# Altium project 8x8_Crosspoint_Switch.PrjPcb (part 3 of 4)

## Sheet EEM.SchDoc: EEM connector
size A3; Author: M.Beldyga; CompanyName: WUT ISE; DrawnBy: M.Beldyga; Organization: WUT ISE; Address1: PW ISE; Address2: Nowowiejska 15/19 00-665 Warsaw; Address3: micbeldyga@gmail.com; SheetNumber: 7; SheetTotal: 8; ModifiedBy: -; CheckedDate: -; DivGrp: WUT ISE; Designer: M.Beldyga; ModifiedDate: -; ProjectName: Sensor Box
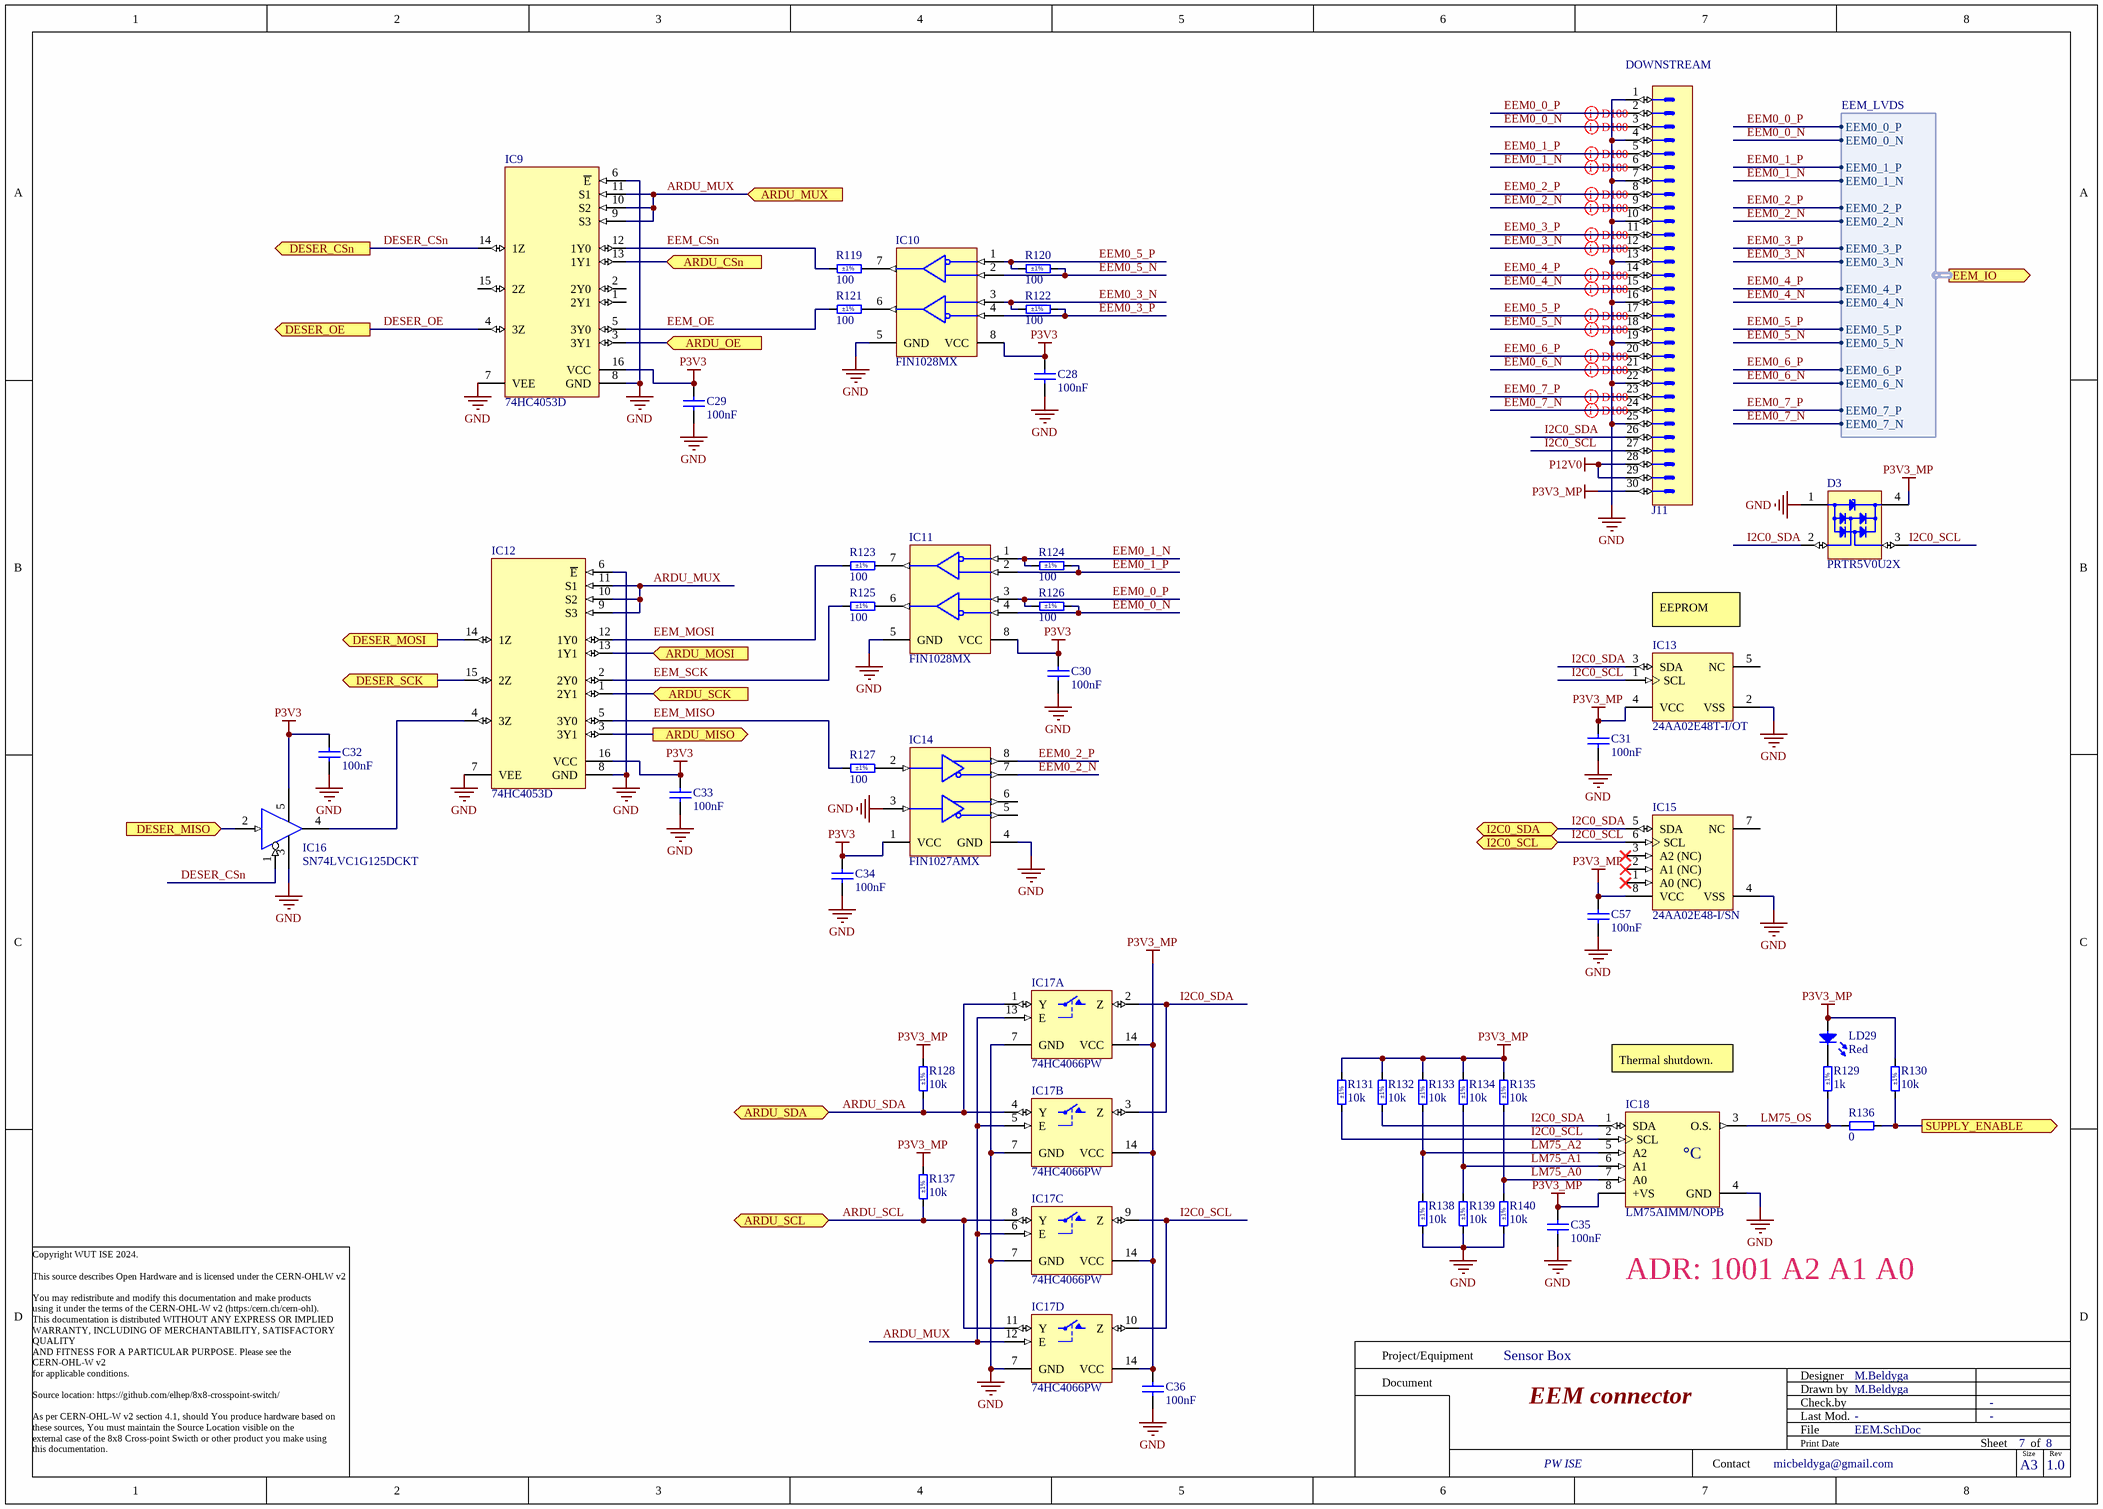
[diagram p6: EEM.SchDoc]

### Parts
C28  100nF  [CAPC1005X55N]
C29  100nF  [CAPC1005X55N]
C30  100nF  [CAPC1005X55N]
C31  100nF  [CAPC1005X55N]
C32  100nF  [CAPC1005X55N]
C33  100nF  [CAPC1005X55N]
C34  100nF  [CAPC1005X55N]
C35  100nF  [CAPC1005X55N]
C36  100nF  [CAPC1005X55N]
C57  100nF  [CAPC1005X55N]
D3  PRTR5V0U2X  [SOT190P230X110-4N]
IC9  74HC4053D  [SOIC127P600X175-16N]
IC10  FIN1028MX  [SOIC127P600X175-8N]
IC11  FIN1028MX  [SOIC127P600X175-8N]
IC12  74HC4053D  [SOIC127P600X175-16N]
IC13  24AA02E48T-I/OT  [SOT95P280X145-5N]
IC14  FIN1027AMX  [SOIC127P600X175-8N]
IC15  24AA02E48-I/SN  [SOIC127P600X175-8N]
IC16  SN74LVC1G125DCKT  [SOT65P210X110-5N]
IC17  74HC4066PW  [SOP65P640X110-14N]  (parts A,B,C,D of 4)
IC18  LM75AIMM/NOPB  [SOP65P490X109-8N]
J11  Header 30  [3M_N2530-6002RB]  (value not drawn)
LD29  Red  [LED_AVAGO_HSMC-C110]
R119  100  Tolerance: ±1%  [RESC1005X40N]
R120  100  Tolerance: ±1%  [RESC1005X40N]
R121  100  Tolerance: ±1%  [RESC1005X40N]
R122  100  Tolerance: ±1%  [RESC1005X40N]
R123  100  Tolerance: ±1%  [RESC1005X40N]
R124  100  Tolerance: ±1%  [RESC1005X40N]
R125  100  Tolerance: ±1%  [RESC1005X40N]
R126  100  Tolerance: ±1%  [RESC1005X40N]
R127  100  Tolerance: ±1%  [RESC1005X40N]
R128  10k  Tolerance: ±1%  [RESC1005X40N]
R129  1k  Tolerance: ±1%  [RESC1005X40N]
R130  10k  Tolerance: ±1%  [RESC1005X40N]
R131  10k  Tolerance: ±1%  [RESC1005X40N]
R132  10k  Tolerance: ±1%  [RESC1005X40N]
R133  10k  Tolerance: ±1%  [RESC1005X40N]
R134  10k  Tolerance: ±1%  [RESC1005X40N]
R135  10k  Tolerance: ±1%  [RESC1005X40N]
R136  0  [RESC1005X40N]
R137  10k  Tolerance: ±1%  [RESC1005X40N]
R138  10k  Tolerance: ±1%  [RESC1005X40N]
R139  10k  Tolerance: ±1%  [RESC1005X40N]
R140  10k  Tolerance: ±1%  [RESC1005X40N]

### Ports
ARDU_CSn (in), ARDU_MISO (out), ARDU_MOSI (in), ARDU_MUX (in), ARDU_OE (in), ARDU_SCK (in), ARDU_SCL (bidir), ARDU_SDA (bidir), DESER_CSn (out), DESER_MISO (in), DESER_MOSI (out), DESER_OE (out), DESER_SCK (out), EEM_IO (out, harness EEM_LVDS), I2C0_SCL (bidir), I2C0_SDA (bidir), SUPPLY_ENABLE (out)

### Harnesses
EEM_LVDS: EEM0_0_P, EEM0_0_N, EEM0_1_P, EEM0_1_N, EEM0_2_P, EEM0_2_N, EEM0_3_P, EEM0_3_N, EEM0_4_P, EEM0_4_N, EEM0_5_P, EEM0_5_N, EEM0_6_P, EEM0_6_N, EEM0_7_P, EEM0_7_N

### Nets
GND: C28.1 C29.1 C30.1 C31.1 C32.1 C33.1 C34.1 C35.1 C36.1 C57.1 D3.1(GND) IC9.6(~{E}) IC9.7(VEE) IC9.8(GND) IC10.5(GND) IC11.5(GND) IC12.6(~{E}) IC12.7(VEE) IC12.8(GND) IC13.2(VSS) IC14.3(DIN2RIN-) IC14.4(GND) IC15.4(VSS) IC16.3(GND) IC17.7(GND) IC18.4(GND) J11.1 J11.4 J11.7 J11.10 J11.13 J11.16 J11.19 J11.22 J11.25 R138.1 R139.1 R140.1
P3V3: C28.2 C29.2 C30.2 C32.2 C33.2 C34.2 IC9.16(VCC) IC10.8(VCC) IC11.8(VCC) IC12.16(VCC) IC14.1(VCC) IC16.5(VCC)
P3V3_MP: C31.2 C35.2 C36.2 C57.2 D3.4(VCC) IC13.4(VCC) IC15.8(VCC) IC17.14(VCC) IC18.8(+VS) J11.30 LD29.2(A) R128.2 R130.2 R131.2 R132.2 R133.2 R134.2 R135.2 R137.2
P12V0: J11.28 J11.29
ARDU_CSn: IC9.13(1Y1) ; port ARDU_CSn
ARDU_MISO: IC12.3(3Y1) ; port ARDU_MISO
ARDU_MOSI: IC12.13(1Y1) ; port ARDU_MOSI
ARDU_MUX: IC9.9(S3) IC9.10(S2) IC9.11(S1) IC12.9(S3) IC12.10(S2) IC12.11(S1) IC17.5(E) IC17.6(E) IC17.12(E) IC17.13(E) ; port ARDU_MUX
ARDU_OE: IC9.3(3Y1) ; port ARDU_OE
ARDU_SCK: IC12.1(2Y1) ; port ARDU_SCK
ARDU_SCL: IC17.8(Y) IC17.11(Y) R137.1 ; port ARDU_SCL
ARDU_SDA: IC17.1(Y) IC17.4(Y) R128.1 ; port ARDU_SDA
DESER_CSn: IC9.14(1Z) IC16.1(~{G}) ; port DESER_CSn
DESER_MISO: IC16.2(IN) ; port DESER_MISO
DESER_MOSI: IC12.14(1Z) ; port DESER_MOSI
DESER_OE: IC9.4(3Z) ; port DESER_OE  [project net DESER_~{OE}]
DESER_SCK: IC12.15(2Z) ; port DESER_SCK
EEM0_0_N: IC11.4(RIN2-) J11.3 R126.2 ; port EEM_IO.EEM0_0_N
EEM0_0_P: IC11.3(RIN2+) J11.2 R126.1 ; port EEM_IO.EEM0_0_P
EEM0_1_N: IC11.1(RIN1-) J11.6 R124.1 ; port EEM_IO.EEM0_1_N
EEM0_1_P: IC11.2(RIN1+) J11.5 R124.2 ; port EEM_IO.EEM0_1_P
EEM0_2_N: IC14.7(DOUT-) J11.9 ; port EEM_IO.EEM0_2_N
EEM0_2_P: IC14.8(DOUT+) J11.8 ; port EEM_IO.EEM0_2_P
EEM0_3_N: IC10.3(RIN2+) J11.12 R122.1 ; port EEM_IO.EEM0_3_N
EEM0_3_P: IC10.4(RIN2-) J11.11 R122.2 ; port EEM_IO.EEM0_3_P
EEM0_4_N: J11.15 ; port EEM_IO.EEM0_4_N
EEM0_4_P: J11.14 ; port EEM_IO.EEM0_4_P
EEM0_5_N: IC10.2(RIN1+) J11.18 R120.2 ; port EEM_IO.EEM0_5_N
EEM0_5_P: IC10.1(RIN1-) J11.17 R120.1 ; port EEM_IO.EEM0_5_P
EEM0_6_N: J11.21 ; port EEM_IO.EEM0_6_N
EEM0_6_P: J11.20 ; port EEM_IO.EEM0_6_P
EEM0_7_N: J11.24 ; port EEM_IO.EEM0_7_N
EEM0_7_P: J11.23 ; port EEM_IO.EEM0_7_P
EEM_CSn: IC9.12(1Y0) R119.1
EEM_MISO: IC12.5(3Y0) R127.1
EEM_MOSI: IC12.12(1Y0) R123.1
EEM_OE: IC9.5(3Y0) R121.1
EEM_SCK: IC12.2(2Y0) R125.1
I2C0_SCL: D3.3(I/O2) IC13.1(SCL) IC15.6(SCL) IC17.9(Z) IC17.10(Z) IC18.2(SCL) J11.27 R131.1 ; port I2C0_SCL
I2C0_SDA: D3.2(I/O1) IC13.3(SDA) IC15.5(SDA) IC17.2(Z) IC17.3(Z) IC18.1(SDA) J11.26 R132.1 ; port I2C0_SDA
LM75_A0: IC18.7(A0) R135.1 R140.2
LM75_A1: IC18.6(A1) R134.1 R139.2
LM75_A2: IC18.5(A2) R133.1 R138.2
LM75_OS: IC18.3(O.S.) R129.1 R136.1
P3V7_EN: R130.1 R136.2 ; port SUPPLY_ENABLE
NetIC10_6: IC10.6(ROUT2) R121.2
NetIC10_7: IC10.7(ROUT1) R119.2
NetIC11_6: IC11.6(ROUT2) R125.2
NetIC11_7: IC11.7(ROUT1) R123.2
NetIC12_4: IC12.4(3Z) IC16.4(OUT)
NetIC14_2: IC14.2(DIN1) R127.2
NetLD29_1: LD29.1(C) R129.2

Not connected (* = marked no-connect by the designer): IC9 1(2Y1) 2(2Y0) 15(2Z); IC13 5(NC); IC14 5(DOUT-) 6(DOUT+); IC15 1(A0_(NC))* 2(A1_(NC))* 3(A2_(NC))* 7(NC)

### Layout directives
differential pair; net class D100: EEM0_0_N, EEM0_0_P, EEM0_1_N, EEM0_1_P, EEM0_2_N, EEM0_2_P, EEM0_3_N, EEM0_3_P, EEM0_4_N, EEM0_4_P, EEM0_5_N, EEM0_5_P, EEM0_6_N, EEM0_6_P, EEM0_7_N, EEM0_7_P

### Notes on the sheet
- (near J11) DOWNSTREAM
- (near IC13) EEPROM
- Thermal shutdown.
- ADR: 1001 A2 A1 A0
- Copyright WUT ISE 2024.
  This source describes Open Hardware and is licensed under the CERN-OHLW v2
  You may redistribute and modify this documentation and make products
  using it under the terms of the CERN-OHL-W v2 (https:/cern.ch/cern-ohl).
  This documentation is distributed WITHOUT ANY EXPRESS OR IMPLIED
  WARRANTY, INCLUDING OF MERCHANTABILITY, SATISFACTORY QUALITY
  AND FITNESS FOR A PARTICULAR PURPOSE. Please see the CERN-OHL-W v2
  for applicable conditions.
  Source location: https://github.com/elhep/8x8-crosspoint-switch/
  As per CERN-OHL-W v2 section 4.1, should You produce hardware based on
  these sources, You must maintain the Source Location visible on the
  external case of the 8x8 Cross-point Swicth or other product you make using
  this documentation.
- Project/Equipment
- Document
- Designer
- Drawn by
- Check.by
- Contact
- File
- Last Mod.
- Print Date
- Sheet
- Size
- A3
- of
- Rev
- (in symbol LM75AIMM/NOPB) °C

### Library data of the parts
C28-C36 C57 = CC0402_100NF_50V_10%_X7R: as C23-C26 on sheet Crosspoint_control; Part Number: CC0402_100NF_50V_10%_X7R; Component Kind: Standard; Component Type: Standard; Pin Count: 2; Value: 100nF; Status: None; Manufacturer Part Number: CC0402_100NF_50V_10%_X7R; Case: 0402; Mounted: Yes; Socket: No; SMD: Yes; Sense: No; Manufacturer1 Example: MURATA; Manufacturer1 ComponentHeight: 0.55mm; HelpURL: \\cern.ch\dfs\Applications\Altium\Datasheets\CC0402_MURATA_GRM155R71H104KE14D.pdf; Author: CERN DEM MR; CreateDate: 6/30/2017; LatestRevisionDate: 6/30/2017
D3 = PRTR5V0U2X: Ultra Low Capacitance Double Rail-to-Rail ESD Protection Diode; Part Description: Ultra Low Capacitance (1pF) Double Rail-to-Rail ESD Protection Diode (8kV); Manufacturer: NXP SEMICONDUCTORS; Voltage: 5.5V; PressFit: No; Bonding: No; Part Number: PRTR5V0U2X; Component Kind: Standard; Component Type: Standard; Device: PRTR5V0U2X; PackageDescription: SOT143B, SOT, 1.90mm Pitch; 4 Pin, 1.30mm W X 2.90mm L X 1.10mm H body, IPC Medium Density; Manufacturer Part Number: PRTR5V0U2X; Pin Count: 4; Case: SOT143B; Mounted: Yes; Socket: No; SMD: Yes; Sense: No; ComponentHeight: 1.1mm; HelpURL: \\cern.ch\dfs\Applications\Altium\Datasheets\PRTR5V0U2X.pdf; Author: CERN DEM JLC; CreateDate: 3/22/2011; LatestRevisionDate: 3/22/2011
IC9 IC12 = 74HC4053D: Triple 2-Channel Analog Multiplexer/Demultiplexer; Manufacturer: NXP SEMICONDUCTORS; PressFit: No; Bonding: No; Part Number: 74HC4053D; Component Kind: Standard; Component Type: Standard; Device: 74HC4053D; PackageDescription: SOIC 16, Pitch 1.27mm - Body 4x10mm, IPC Medium Density; Part Description: Triple 2-channel analog multiplexer/demultiplexer; Manufacturer Part Number: 74HC4053D; Pin Count: 16; Case: SOIC16; Mounted: Yes; Socket: No; SMD: Yes; Sense: No; ComponentHeight: 1.75mm; Author: CERN DEM JLC; HelpURL: \\cern.ch\dfs\Applications\Altium\Datasheets\74HC4053D.pdf; CreateDate: 11/9/2016; LatestRevisionDate: 11/9/2016
IC10 IC11 = FIN1028: 3.3V LVDS 2-Bit High-Speed Differential Reciever; Manufacturer: ON Semiconductor; PressFit: No; Bonding: No; Part Number: FIN1028MX; Component Kind: Standard; Component Type: Standard; Device: FIN1028MX; PackageDescription: SOIC 8, Pitch 1.27mm - Body 4x5mm, IPC Medium Density; Part Description: 3.3V LVDS 2-Bit High-Speed Differential Reciever; Manufacturer Part Number: FIN1028MX; Pin Count: 8; Case: SOIC8; Mounted: Yes; Socket: No; SMD: Yes; Sense: No; ComponentHeight: 0.8mm; Author: GK; HelpURL: \\cern.ch\dfs\Applications\Altium\Datasheets\FIN1101K8X.pdf; CreateDate: 08/11/2016; LatestRevisionDate: 08/11/2016
IC13 = 24AA02E48T-I/OT: 1.7V-5.5V, 2K I2C Serial EEPROM With EUI-48 Node Identity; Manufacturer: MICROCHIP TECHNOLOGY; PressFit: No; Bonding: No; Part Number: 24AA02E48T-I/OT; Component Kind: Standard; Component Type: Standard; Device: 24AA02E48T-I/OT; PackageDescription: SOT, 0.95mm pitch; 5 pin, 1.60mm W X 2.90mm L X 1.45mm H body, IPC Medium Density; Part Description: 1.7V-5.5V, 2K I2C Serial EEPROM with EUI-48 Node Identity; Manufacturer Part Number: 24AA02E48T-I/OT; Pin Count: 5; Case: SOT23-5; Mounted: Yes; Socket: No; SMD: Yes; Sense: No; ComponentHeight: 1.45mm; HelpURL: \\cern.ch\dfs\Applications\Altium\Datasheets\24AA02E48T-I-OT.pdf; Author: CERN DEM MR; CreateDate: 3/31/2016; LatestRevisionDate: 3/31/2016
IC14 = FIN1027A: 3.3V LVDS, 2-Bit, High-Speed, Differential Driver; Manufacturer: ON Semiconductor; PressFit: No; Bonding: No; Part Number: FIN1027AMX; Component Kind: Standard; Component Type: Standard; Device: FIN1027AMX; PackageDescription: SOIC 8, Pitch 1.27mm - Body 4x5mm, IPC Medium Density; Part Description: 3.3V LVDS, 2-Bit, High-Speed, Differential Driver; Manufacturer Part Number: FIN1027AMX; Pin Count: 8; Case: SOIC8; Mounted: Yes; Socket: No; SMD: Yes; Sense: No; ComponentHeight: 0.8mm; Author: GK; HelpURL: \\cern.ch\dfs\Applications\Altium\Datasheets\FIN1101K8X.pdf; CreateDate: 08/11/2016; LatestRevisionDate: 08/11/2016
IC15 = MEM_24AA02E48-I/SN: 1.7V-5.5V, 2K I2C™ Serial EEPROMs with EUI-48™ Node Identity; Manufacturer: MICROCHIP TECHNOLOGY; PressFit: No; Bonding: No; Part Number: 24AA02E48-I/SN; Component Kind: Standard; Component Type: Standard; Device: 24AA02E48-I/SN; PackageDescription: SOIC, 1.27mm Pitch; 8 Pin - Body 4x5mm, IPC Medium Density; Part Description: 1.7V-5.5V, 2K I2C™ Serial EEPROMs with EUI-48™ Node Identity; Manufacturer Part Number: 24AA02E48-I/SN; Pin Count: 8; Case: SOIC8; Mounted: Yes; Socket: No; SMD: Yes; Sense: No; ComponentHeight: 1.75mm; HelpURL: \\cern.ch\dfs\Applications\Altium\Datasheets\24AA025E48-I-SN.pdf; Author: CERN DEM MR; CreateDate: 19.07.2016; LatestRevisionDate: 19.07.2016
IC16 = 741G125: Single Bus Buffer Gate With 3-State Output; Part Description: Single Bus Buffer Gate With 3-State Outputs; Manufacturer: TEXAS INSTRUMENTS; PressFit: No; Bonding: No; Part Number: SN74LVC1G125DCKT; Component Kind: Standard; Component Type: Standard; Device: SN74LVC1G125DCKT; PackageDescription: SOT353, SC70-5, SOT, 0.65mm Pitch, 5 pin, 1.25mm W X 2.00mm L X 1.10mm H, IPC Medium Density; Manufacturer Part Number: SN74LVC1G125DCKT; Pin Count: 5; Case: SOT353; Mounted: Yes; Socket: No; SMD: Yes; Sense: No; ComponentHeight: 1.1mm; Author: CERN DEM JLC; HelpURL: \\cern.ch\dfs\Applications\Altium\Datasheets\SN74LVC1G125DCKT.pdf; CreateDate: 12/19/2011; LatestRevisionDate: 12/19/2011
IC17 = 74HC4066PW: Quad Single-Pole Single-Throw Analog Switch; Manufacturer: NXP SEMICONDUCTORS; PressFit: No; Bonding: No; Part Number: 74HC4066PW; Component Kind: Standard; Component Type: Standard; Device: 74HC4066PW; PackageDescription: SOP, 0.65mm Pitch; 14 Pin, 4.40mm W X 5.00mm L X 1.20mm H body, IPC Medium Density; Part Description: Quad Single-Pole Single-Throw Analog Switch; Manufacturer Part Number: 74HC4066PW; Pin Count: 14; Case: TSSOP14; Mounted: Yes; Socket: No; SMD: Yes; Sense: No; ComponentHeight: 1.1mm; Author: CERN DEM JLC; HelpURL: \\cern.ch\dfs\Applications\Altium\Datasheets\74HC4066PW.pdf; CreateDate: 11/19/2014; LatestRevisionDate: 11/19/2014
IC18 = LM75AIMM/NOPB: Digital Temperature Sensor and Thermal Watchdog with Two-Wire Interface; Part Description: -25° to +100°C ±2°C Digital Temperature Sensor and Thermal Watchdog with Two-Wire Interface; Manufacturer: TEXAS INSTRUMENTS; PressFit: No; Bonding: No; Part Number: LM75AIMM/NOPB; Component Kind: Standard; Component Type: Standard; Device: LM75AIMM/NOPB; PackageDescription: SOP, 0.65mm Pitch; 8 Pin, 3.00mm W X 3.00mm L X 1.09mm H body, IPC Medium Density; Manufacturer Part Number: LM75AIMM; Pin Count: 8; Case: SSOP8; Mounted: Yes; Socket: No; SMD: Yes; Sense: No; ComponentHeight: 1.09mm; HelpURL: \\cern.ch\dfs\Applications\Altium\Datasheets\LM75AIMM-NOPB.pdf; Author: CERN DEM JLC; CreateDate: 10/15/2012; LatestRevisionDate: 6/1/2022
J11 = 3M_N2530-6002RB: Connector 30 Male; Part Description: 30 Contacts, Straight .100'' x .100'' Low Profile Four-Wall Header, (Solder Tail 2.84mm), 2500 Series; Manufacturer: 3M; PressFit: No; Part Number: 3M_N2530-6002RB; Component Kind: Standard; Component Type: Standard; Pin Count: 30; Family: Header 30; Mounted: Yes; Socket: No; SMD: No; Sense: No; Status: None; Manufacturer Part Number: N2530-6002RB; ComponentHeight: 10.03mm; HelpURL: \\cern.ch\dfs\Applications\Altium\Datasheets\3M_N2530-6002RB.pdf; Author: CERN DEM JLC; CreateDate: 2/11/2009; LatestRevisionDate: 10/27/2022
LD29 = LED_AVAGO_HSMC-C110: LED Red 1C 2A; Part Description: High Performance Right Angle Chip Red LED; Manufacturer: AVAGO TECHNOLOGIES; PressFit: No; Bonding: No; Part Number: LED_AVAGO_HSMC-C110; Component Kind: Standard; Component Type: Standard; Color: Red; PackageDescription: Red Chip LED, 2-Leads, Body 3.3x1.6mm, Side Emitting Package; Manufacturer Part Number: HSMC-C110; Pin Count: 2; Case: 1206; Mounted: Yes; Socket: No; SMD: Yes; Sense: No; ComponentHeight: 1.1mm; HelpURL: \\cern.ch\dfs\Applications\Altium\Datasheets\LED_AVAGO_HSMC-C110.pdf; ComponentLink1URL: \\cern.ch\dfs\Applications\Altium\Datasheets\LED_AVAGO_HSMC-C110_DESIGN-GUIDE.pdf; ComponentLink1Description: Design Guide; Author: CERN DEM JMW; CreateDate: 7/30/2009; LatestRevisionDate: 6/20/2012
R119-R127 = R0402_100R_1%_0.1W_100PPM: Resistor - 1%; Part Description: General Purpose Thick Film Chip Resistor; Manufacturer: GENERIC; Manufacturer Part Number: R0402_100R_1%_0.1W_100PPM_50V; Manufacturer1 Part Number: ERJ2RKF1000X; Power: 0.1W; TC: ±100ppm/°C; Voltage: 50V; PressFit: No; Part Number: R0402_100R_1%_0.1W_100PPM; Component Kind: Standard; Component Type: Standard; Pin Count: 2; Value: 100; Status: Not Recommended; Case: 0402; Mounted: Yes; Sense: No; Socket: No; SMD: Yes; Manufacturer1 Example: PANASONIC; Manufacturer1 ComponentHeight: 0.4mm; HelpURL: \\cern.ch\dfs\Applications\Altium\Datasheets\R0402_PANASONIC_ERJ2RK.pdf; Author: CERN DEM JLC; CreateDate: 12/12/2013; LatestRevisionDate: 3/3/2015
R128 R130-R135 R137-R140 = R0402_10K_1%_0.0625W_100PPM: Resistor - 1%; Part Description: General Purpose Thick Film Chip Resistor; Manufacturer: GENERIC; Manufacturer1 Part Number: 232270671003L; TC: ±100ppm/°C; PressFit: No; Part Number: R0402_10K_1%_0.0625W_100PPM; Component Kind: Standard; Component Type: Standard; Pin Count: 2; Value: 10k; Status: Not Recommended; Power: 0.0625W; Manufacturer Part Number: R0402_10K_1%_0.0625W_100PPM; Case: 0402; Mounted: Yes; Sense: No; Socket: No; SMD: Yes; Manufacturer1 Example: YAGEO PHYCOMP; Manufacturer1 ComponentHeight: 0.4mm; HelpURL: \\cern.ch\dfs\Applications\Altium\Datasheets\R0402_Phycomp_RC0402.pdf; Author: CERN DEM JLC; CreateDate: 12/3/2007; LatestRevisionDate: 10/17/2012
R129 = R0402_1K_1%_0.0625W_100PPM: Resistor - 1%; Part Description: General Purpose Thick Film Chip Resistor; Manufacturer: GENERIC; Manufacturer1 Part Number: 232270671002L; TC: ±100ppm/°C; PressFit: No; Part Number: R0402_1K_1%_0.0625W_100PPM; Component Kind: Standard; Component Type: Standard; Pin Count: 2; Value: 1k; Status: Not Recommended; Power: 0.0625W; Manufacturer Part Number: R0402_1K_1%_0.0625W_100PPM; Case: 0402; Mounted: Yes; Sense: No; Socket: No; SMD: Yes; Manufacturer1 Example: YAGEO PHYCOMP; Manufacturer1 ComponentHeight: 0.4mm; HelpURL: \\cern.ch\dfs\Applications\Altium\Datasheets\R0402_Phycomp_RC0402.pdf; Author: CERN DEM JLC; CreateDate: 12/3/2007; LatestRevisionDate: 10/17/2012
R136 = R0402_0R_JUMPER: Resistor; Part Description: 1A (0.05R Max DC Resistance) Zero Ohm Jumper; Manufacturer: GENERIC; Manufacturer1 Part Number: 232270591001L; PressFit: No; Part Number: R0402_0R_JUMPER; Component Kind: Standard; Component Type: Standard; Pin Count: 2; Value: 0; Status: Not Recommended; Manufacturer Part Number: R0402_0R_JUMPER; Case: 0402; Mounted: Yes; Sense: No; Socket: No; SMD: Yes; Manufacturer1 Example: YAGEO PHYCOMP; Manufacturer1 ComponentHeight: 0.4mm; HelpURL: \\cern.ch\dfs\Applications\Altium\Datasheets\R0402_Phycomp_RC0402.pdf; Author: CERN DEM JLC; CreateDate: 12/3/2007; LatestRevisionDate: 10/17/2012

## Sheet Supply.SchDoc: Power Supply
size A3; Author: M.Beldyga; CompanyName: WUT ISE; DrawnBy: M.Beldyga; Organization: WUT ISE; Address1: PW ISE; Address2: Nowowiejska 15/19 00-665 Warsaw; Address3: micbeldyga@gmail.com; SheetNumber: 8; SheetTotal: 8; ModifiedBy: -; CheckedDate: -; DivGrp: WUT ISE; Designer: M.Beldyga; ModifiedDate: -; ProjectName: Sensor Box
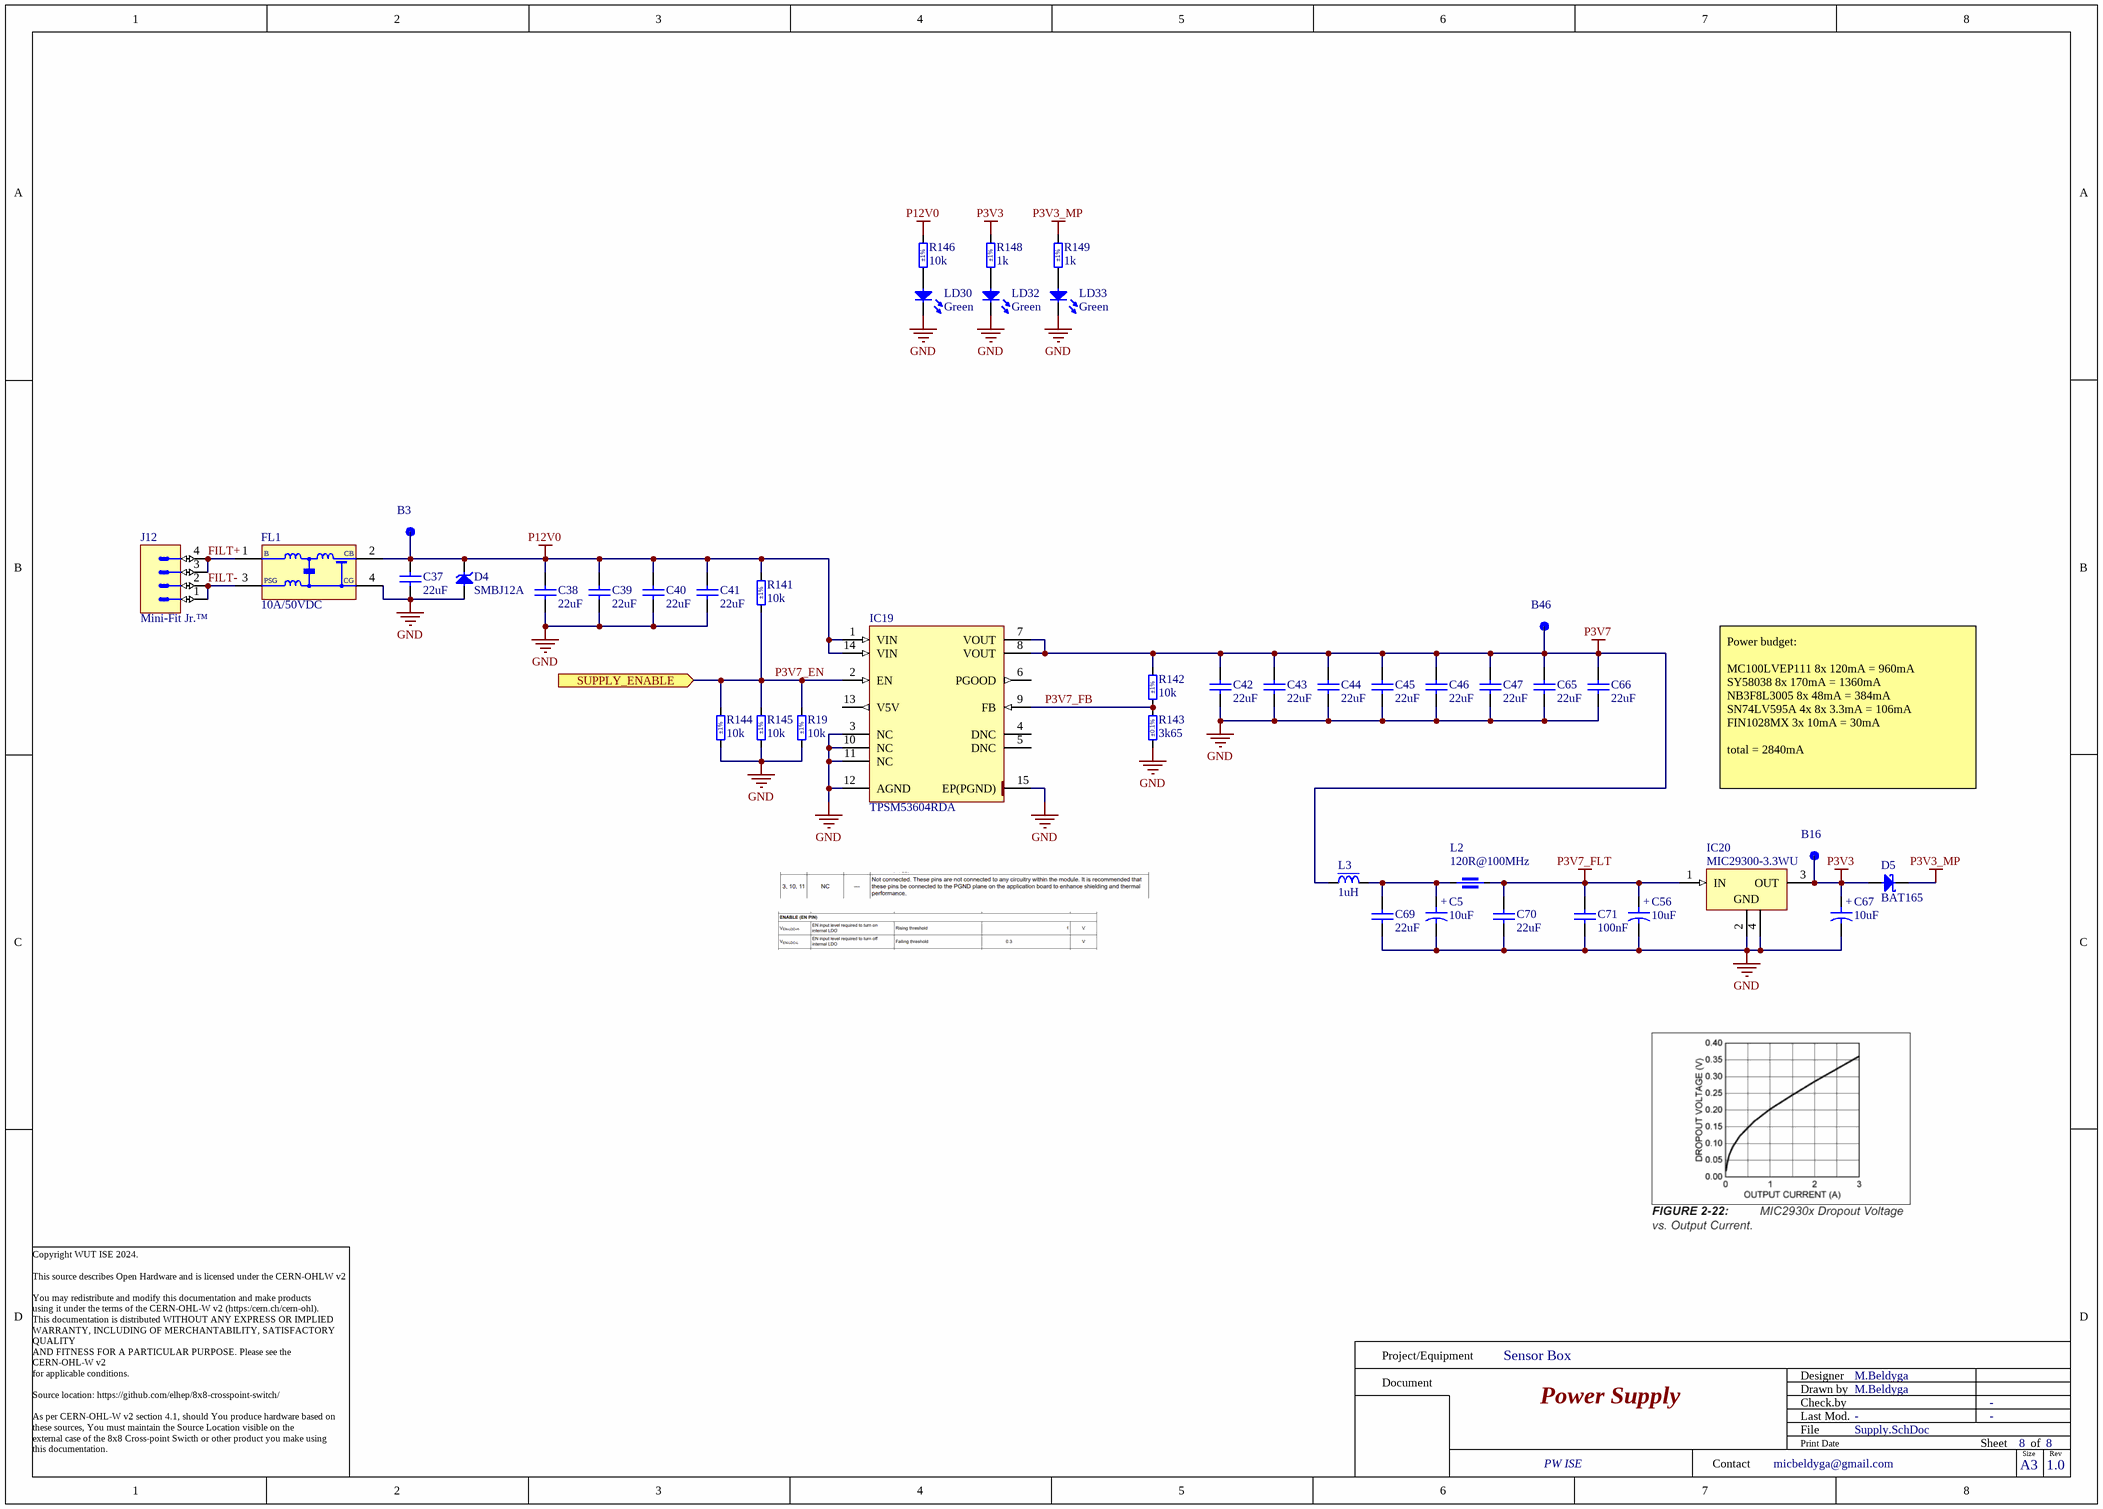
[diagram p7: Supply.SchDoc]

### Parts
B3  SMD Pad  [C100]  (value not drawn)  (no BOM)
B16  SMD Pad  [C100]  (value not drawn)  (no BOM)
B46  SMD Pad  [C100]  (value not drawn)  (no BOM)
C5  10uF  [CAPMP3216X180N]
C37  22uF  [CAPC2012X135N]
C38  22uF  [CAPC2012X135N]
C39  22uF  [CAPC2012X135N]
C40  22uF  [CAPC2012X135N]
C41  22uF  [CAPC2012X135N]
C42  22uF  [CAPC2012X135N]
C43  22uF  [CAPC2012X135N]
C44  22uF  [CAPC2012X135N]
C45  22uF  [CAPC2012X135N]
C46  22uF  [CAPC2012X135N]
C47  22uF  [CAPC2012X135N]
C56  10uF  [CAPMP3216X180N]
C65  22uF  [CAPC2012X135N]
C66  22uF  [CAPC2012X135N]
C67  10uF  [CAPMP3216X180N]
C69  22uF  [CAPC2012X135N]
C70  22uF  [CAPC2012X135N]
C71  100nF  [CAPC1005X55N]
D4  SMBJ12A  [DIOM5336X265N]
D5  BAT165  [SOD2512X110N]
FL1  10A/50VDC  [FIL_MURATA_BNX02]
IC19  TPSM53604RDA  [TEXAS_RDA0015A (B3QFN)]
IC20  MIC29300-3.3WU  [TO254P1524X460-4N-S769X1066]
J12  Mini-Fit Jr.™  [MOLEX_39-30-0040]
L2  120R@100MHz  [INDC1608X65N]
L3  1uH  [IND_COILCRAFT_PFL3215]
LD30  Green  [LED_KINGBRIGHT_KP-1608CGCK]
LD32  Green  [LED_KINGBRIGHT_KP-1608CGCK]
LD33  Green  [LED_KINGBRIGHT_KP-1608CGCK]
R19  10k  Tolerance: ±1%  [RESC1005X40N]
R141  10k  Tolerance: ±1%  [RESC1005X40N]
R142  10k  Tolerance: ±1%  [RESC1005X40N]
R143  3k65  Tolerance: ±0.1%  [RESC1608X55N]
R144  10k  Tolerance: ±1%  [RESC1005X40N]
R145  10k  Tolerance: ±1%  [RESC1005X40N]
R146  10k  Tolerance: ±1%  [RESC1005X40N]
R148  1k  Tolerance: ±1%  [RESC1005X40N]
R149  1k  Tolerance: ±1%  [RESC1005X40N]

### Ports
SUPPLY_ENABLE (in)

### Nets
GND: C5.2 C37.1 C38.1 C39.1 C40.1 C41.1 C42.1 C43.1 C44.1 C45.1 C46.1 C47.1 C56.2 C65.1 C66.1 C67.2 C69.1 C70.1 C71.1 D4.2(A) FL1.4(CG) IC19.3(NC) IC19.10(NC) IC19.11(NC) IC19.12(AGND) IC19.15(EP(PGND)) IC20.2(GND) IC20.4(GND) LD30.1(C) LD32.1(C) LD33.1(C) R19.2 R143.1 R144.2 R145.2
P3V3: B16.1 C67.1 D5.2(A) IC20.3(OUT) R148.2
P3V3_MP: D5.1(C) R149.2
P3V7: B46.1 C42.2 C43.2 C44.2 C45.2 C46.2 C47.2 C65.2 C66.2 IC19.7(VOUT) IC19.8(VOUT) L3.1 R142.1
P3V7_FLT: C56.1 C70.2 C71.2 IC20.1(IN) L2.2
P12V0: B3.1 C37.2 C38.2 C39.2 C40.2 C41.2 D4.1(C) FL1.2(CB) IC19.1(VIN) IC19.14(VIN) R141.1 R146.1
FILT+: FL1.1(B) J12.3 J12.4
FILT-: FL1.3(PSG) J12.1 J12.2
P3V7_EN: IC19.2(EN) R19.1 R141.2 R144.1 R145.1 ; port SUPPLY_ENABLE
P3V7_FB: IC19.9(FB) R142.2 R143.2
NetC5_1: C5.1 C69.2 L2.1 L3.2
NetLD30_2: LD30.2(A) R146.2
NetLD32_2: LD32.2(A) R148.1
NetLD33_2: LD33.2(A) R149.1

Not connected (* = marked no-connect by the designer): IC19 4(DNC) 5(DNC) 6(PGOOD) 13(V5V)

### Notes on the sheet
- Power budget:
  MC100LVEP111 8x 120mA = 960mA
  SY58038 8x 170mA = 1360mA
  NB3F8L3005 8x 48mA = 384mA
  SN74LV595A 4x 8x 3.3mA = 106mA
  FIN1028MX 3x 10mA = 30mA
  total = 2840mA
- Copyright WUT ISE 2024.
  This source describes Open Hardware and is licensed under the CERN-OHLW v2
  You may redistribute and modify this documentation and make products
  using it under the terms of the CERN-OHL-W v2 (https:/cern.ch/cern-ohl).
  This documentation is distributed WITHOUT ANY EXPRESS OR IMPLIED
  WARRANTY, INCLUDING OF MERCHANTABILITY, SATISFACTORY QUALITY
  AND FITNESS FOR A PARTICULAR PURPOSE. Please see the CERN-OHL-W v2
  for applicable conditions.
  Source location: https://github.com/elhep/8x8-crosspoint-switch/
  As per CERN-OHL-W v2 section 4.1, should You produce hardware based on
  these sources, You must maintain the Source Location visible on the
  external case of the 8x8 Cross-point Swicth or other product you make using
  this documentation.
- Project/Equipment
- Document
- Designer
- Drawn by
- Check.by
- Contact
- File
- Last Mod.
- Print Date
- Sheet
- Size
- A3
- of
- Rev
- (in symbol CTE3216-18_10UF_16V_20%_AVX_TCJ) +

### Library data of the parts
B3 B16 B46 = SMD_PAD_D1MM: as B24-B27 on sheet DIOT_P1; Part Number: SMD_PAD_D1MM; Component Type: Standard (No BOM); Pin Count: 1; Family: SMD Pad; Socket: No; SMD: Yes; Sense: No; Status: None; ComponentHeight: 0mm; HelpURL: Undefined; Author: CERN DEM JLC; CreateDate: 10/10/2017; LatestRevisionDate: 10/10/2017; PackageDescription: 1mm Diameter SMD Pad
C5 C56 C67 = CTE3216-18_10UF_16V_20%_AVX_TCJ: Polarised capacitor; Part Description: ESR 0R200 Tantalum Solid Electrolytic Chip Capacitor with Conductive Polymer Electrode; Manufacturer: AVX; Manufacturer Part Number: TCJA106M016R0200; Voltage: 16V; Tolerance: ±20%; Part Number: CTE3216-18_10UF_16V_20%_AVX_TCJ; Component Kind: Standard; Component Type: Standard; Pin Count: 2; Value: 10uF; Status: Preferred; Case: A; Mounted: Yes; Socket: No; SMD: Yes; Sense: No; ComponentHeight: 1.8mm; HelpURL: \\cern.ch\dfs\Applications\Altium\Datasheets\CTE_AVX_TCJ.pdf; Author: CERN DEM JLC; CreateDate: 3/29/2012; LatestRevisionDate: 3/29/2012
C37-C47 C65 C66 C69 C70 = CC0805_22UF_16V_10%_X5R: Non-polarised capacitor; Part Description: SMD Multilayer Chip Ceramic Capacitor; Manufacturer: GENERIC; Manufacturer1 Part Number: C2012X5R1C226KT; Voltage: 16V; TC: X5R; Tolerance: ±10%; Part Number: CC0805_22UF_16V_10%_X5R; Component Kind: Standard; Component Type: Standard; Pin Count: 2; Value: 22uF; Status: Preferred; Manufacturer Part Number: CC0805_22UF_16V_10%_X5R; Case: 0805; Mounted: Yes; Socket: No; SMD: Yes; Sense: No; Manufacturer1 Example: TDK; Manufacturer1 ComponentHeight: 1.35mm; HelpURL: \\cern.ch\dfs\Applications\Altium\Datasheets\CC0805_X5R_TDK_C.pdf; Author: CERN DEM JLC; CreateDate: 10/25/2012; LatestRevisionDate: 10/25/2012
C71 = CC0402_100NF_50V_10%_X7R: as C23-C26 on sheet Crosspoint_control; Part Number: CC0402_100NF_50V_10%_X7R; Component Kind: Standard; Component Type: Standard; Pin Count: 2; Value: 100nF; Status: None; Manufacturer Part Number: CC0402_100NF_50V_10%_X7R; Case: 0402; Mounted: Yes; Socket: No; SMD: Yes; Sense: No; Manufacturer1 Example: MURATA; Manufacturer1 ComponentHeight: 0.55mm; HelpURL: \\cern.ch\dfs\Applications\Altium\Datasheets\CC0402_MURATA_GRM155R71H104KE14D.pdf; Author: CERN DEM MR; CreateDate: 6/30/2017; LatestRevisionDate: 6/30/2017
D4 = SMBJ12A: Zener Diode; Part Description: Uni-Directional Transient Voltage Suppressor Diode; Manufacturer: FAIRCHILD SEMICONDUCTOR; Voltage: 12V; Power: 600W; PressFit: No; Bonding: No; Part Number: SMBJ12A; Component Kind: Standard; Component Type: Standard; Device: SMBJ12A; PackageDescription: DO-214-AA/SMB Diode, Molded Body; 5.34mm L X 3.625mm W X 2.65mm H, IPC Medium Density; Manufacturer Part Number: SMBJ12A; Pin Count: 2; Case: DO-214AA; Mounted: Yes; Socket: No; SMD: Yes; Sense: No; ComponentHeight: 2.65mm; HelpURL: \\cern.ch\dfs\Applications\Altium\Datasheets\SMBJ.pdf; Author: CERN DEM JLC; CreateDate: 4/10/2013; LatestRevisionDate: 4/10/2013
D5 = BAT165: Schottky Diode; Part Description: Medium Power AF Schottky Diode; Manufacturer: INFINEON; Voltage: 40V; Power: 750mA; PressFit: No; Bonding: No; Part Number: BAT165; Component Kind: Standard; Component Type: Standard; Device: BAT165; PackageDescription: Small Outline Diode (SOD-323), 1.70mm W X 1.25mm L X 1.10mm H body,  IPC Medium Density; Manufacturer Part Number: BAT165; Pin Count: 2; Case: SOD-323; Mounted: Yes; Socket: No; SMD: Yes; Sense: No; ComponentHeight: 1.1mm; HelpURL: \\cern.ch\dfs\Applications\Altium\Datasheets\BAT165.pdf; Author: CERN DEM JLC; CreateDate: 11/12/2014; LatestRevisionDate: 11/12/2014
FL1 = FIL_MURATA_BNX022-01L: Block Type EMIFIL (LC Combined); Part Description: Block Type EMIFIL (LC Combined) SMD Type, BNX02* Series; Manufacturer: MURATA; Resistance: 0.5R; Part Number: FIL_MURATA_BNX022-01L; Component Kind: Standard; Component Type: Standard; Pin Count: 2; Value: 10A/50VDC; Manufacturer Part Number: BNX022-01L; Mounted: Yes; Socket: No; SMD: Yes; Sense: No; ComponentHeight: 3.3mm; HelpURL: \\cern.ch\dfs\Applications\Altium\Datasheets\FIL_MURATA_BNX022-01L.pdf; Author: CERN DEM JLC; CreateDate: 10/10/2012; LatestRevisionDate: 10/10/2012
IC19 = TPSM53604RDA: 3.8V to 36V Input, 1V to 7V Output, 4A Power Module in Enhanced HotRod™; Manufacturer: TEXAS INSTRUMENTS; PressFit: No; Bonding: No; Status Comment: Solder Paste Deposition Limitation; Part Number: TPSM53604RDA; Component Kind: Standard; Component Type: Standard; Device: TPSM53604RDA; PackageDescription: TEXAS Case Style RDA0015A, DFN, 0.65mm Pitch; 14 Pin, 5.00mm W X 5.50mm L X 4.10mm H body (w/Thermal Tab 2.55 X 4.65mm); Status: Not Recommended; Part Description: 3.8V to 36V Input, 1V to 7V Output, 4A Power Module in Enhanced HotRod™; Manufacturer Part Number: TPSM53604RDA; Pin Count: 15; Case: DFN14; Mounted: Yes; Socket: No; SMD: Yes; Sense: No; ComponentHeight: 4.1mm; HelpURL: \\cern.ch\dfs\Applications\Altium\Datasheets\TPSM53604RDA.pdf; Author: CERN DEM BC; CreateDate: 3/30/2021; LatestRevisionDate: 3/30/2021
IC20 = MIC29300-3.3WU: 3-Terminal Regulator 1=IN 2=GND 3=OUT 4=GND; Part Description: 3.3V, 3A, High-Current Low Dropout Regulator (RoHS); Manufacturer: MICREL; PressFit: No; Bonding: No; Part Number: MIC29300-3.3WU; Component Kind: Standard; Component Type: Standard; Device: MIC29300-3.3WU; PackageDescription: D2PAK TO-263, TO, 2.54mm Pitch; 4 Pin, 15.24mm L X 10.36mm W X 4.597mm H body, IPC Medium Density; Manufacturer Part Number: MIC29300-3.3WU; Pin Count: 4; Case: TO-263-3; Mounted: Yes; Socket: No; SMD: Yes; Sense: No; ComponentHeight: 4.6mm; HelpURL: \\cern.ch\dfs\Applications\Altium\Datasheets\MIC29300-3.3WU.pdf; Author: CERN DEM JLC; CreateDate: 8/22/2011; LatestRevisionDate: 8/8/2012
J12 = MOLEX_39-30-0040: Connector 4 Male; Part Description: 4.20mm (.165") Pitch Mini-Fit Jr. Header, Dual Row, Right Angle with Snap-in Plastic Peg PCB Lock, 4 Circuits; Manufacturer: MOLEX; PressFit: No; Part Number: MOLEX_39-30-0040; Component Kind: Standard; Component Type: Standard; Pin Count: 4; Family: Mini-Fit Jr.™; Mounted: Yes; Socket: No; SMD: No; Sense: No; Status: None; Manufacturer Part Number: 39-30-0040; ComponentHeight: 11.4mm; HelpURL: \\cern.ch\dfs\Applications\Altium\Datasheets\MOLEX_39-30-0040.pdf; Author: CERN DEM JLC; CreateDate: 10/2/2018; LatestRevisionDate: 10/2/2018
L2 = IND0603_MURATA_BLM18SG121TN1D: Part Description: SMD EMIFIL Suppression Chip Ferrite Bead; Manufacturer: MURATA; Power: 3A; Resistance: 0.025R; Tolerance: ±25%; Part Number: IND0603_MURATA_BLM18SG121TN1D; Component Kind: Standard; Component Type: Standard; Pin Count: 2; Value: 120R@100MHz; Manufacturer Part Number: BLM18SG121TN1D; Case: 0603; Mounted: Yes; Socket: No; SMD: Yes; Sense: No; ComponentHeight: 0.65mm; HelpURL: \\cern.ch\dfs\Applications\Altium\Datasheets\IND0603_MURATA_BLM18S.pdf; Author: CERN DEM JLC; CreateDate: 7/23/2014; LatestRevisionDate: 10/25/2018
L3 = IND_1UH_20%_COILCRAFT_PFL3215: Inductor With Core; Part Description: SMD Shielded Power Inductor; Manufacturer Part Number: PFL3215-102MEB; Power: 1.9A; Resistance: 0.038R; Tolerance: ±20%; Part Number: IND_1UH_20%_COILCRAFT_PFL3215; Component Kind: Standard; Component Type: Standard; Pin Count: 2; Value: 1uH; Manufacturer: COILCRAFT; Mounted: Yes; Socket: No; SMD: Yes; Sense: No; ComponentHeight: 1.5mm; HelpURL: \\cern.ch\dfs\Applications\Altium\Datasheets\IND_COILCRAFT_PFL3215.pdf; Author: CERN DEM MR; CreateDate: 3/14/2016; LatestRevisionDate: 3/14/2016
LD30 LD32 LD33 = LED_KINGBRIGHT_KP-1608CGCK: LED Green 1C 2A; Part Description: 1.6x0.8mm SMD Chip Green LED Lamp; PressFit: No; Bonding: No; Part Number: LED_KINGBRIGHT_KP-1608CGCK; Component Kind: Standard; Component Type: Standard; Color: Green; PackageDescription: SMT Green LED, Case 0603, Body L 1.60mm x W 0.80mm x H 1.10mm; Manufacturer: KINGBRIGHT; Manufacturer Part Number: KP-1608CGCK; Pin Count: 2; Case: 0603; Mounted: Yes; Socket: No; SMD: Yes; Sense: No; ComponentHeight: 1.1mm; HelpURL: \\cern.ch\dfs\Applications\Altium\Datasheets\LED_KINGBRIGHT_KP-1608CGCK.pdf; Author: CERN DEM HF; CreateDate: 10/1/2021; LatestRevisionDate: 10/1/2021
R19 R141 R142 R144-R146 = R0402_10K_1%_0.0625W_100PPM: as R128 on sheet EEM; Part Number: R0402_10K_1%_0.0625W_100PPM; Component Kind: Standard; Component Type: Standard; Pin Count: 2; Value: 10k; Status: Not Recommended; Power: 0.0625W; Manufacturer Part Number: R0402_10K_1%_0.0625W_100PPM; Case: 0402; Mounted: Yes; Sense: No; Socket: No; SMD: Yes; Manufacturer1 Example: YAGEO PHYCOMP; Manufacturer1 ComponentHeight: 0.4mm; HelpURL: \\cern.ch\dfs\Applications\Altium\Datasheets\R0402_Phycomp_RC0402.pdf; Author: CERN DEM JLC; CreateDate: 12/3/2007; LatestRevisionDate: 10/17/2012
R143 = R0603_3K65_0.1%_0.063W_10PPM: Resistor - 0.1%; Part Description: Thin Film Chip Resistor; Manufacturer: GENERIC; Manufacturer1 Part Number: RN73C1J3K65BTDF; Power: 0.063W; TC: ±10ppm; PressFit: No; Part Number: R0603_3K65_0.1%_0.063W_10PPM; Component Kind: Standard; Component Type: Standard; Pin Count: 2; Value: 3k65; Status: Not Recommended; Manufacturer Part Number: R0603_3K65_0.1%_0.063W_10PPM; Case: 0603; Mounted: Yes; Sense: No; Socket: No; SMD: Yes; Manufacturer1 Example: TYCO HOLSWORTHY; Manufacturer1 ComponentHeight: 0.5mm; HelpURL: \\cern.ch\dfs\Applications\Altium\Datasheets\R0603_Tyco_RN73.pdf; Author: CERN DEM JLC; CreateDate: 12/3/2007; LatestRevisionDate: 3/13/2008
R148 R149 = R0402_1K_1%_0.0625W_100PPM: as R129 on sheet EEM; Part Number: R0402_1K_1%_0.0625W_100PPM; Component Kind: Standard; Component Type: Standard; Pin Count: 2; Value: 1k; Status: Not Recommended; Power: 0.0625W; Manufacturer Part Number: R0402_1K_1%_0.0625W_100PPM; Case: 0402; Mounted: Yes; Sense: No; Socket: No; SMD: Yes; Manufacturer1 Example: YAGEO PHYCOMP; Manufacturer1 ComponentHeight: 0.4mm; HelpURL: \\cern.ch\dfs\Applications\Altium\Datasheets\R0402_Phycomp_RC0402.pdf; Author: CERN DEM JLC; CreateDate: 12/3/2007; LatestRevisionDate: 10/17/2012